# EAGLE schematic layout (EAGLE 9.5.0)
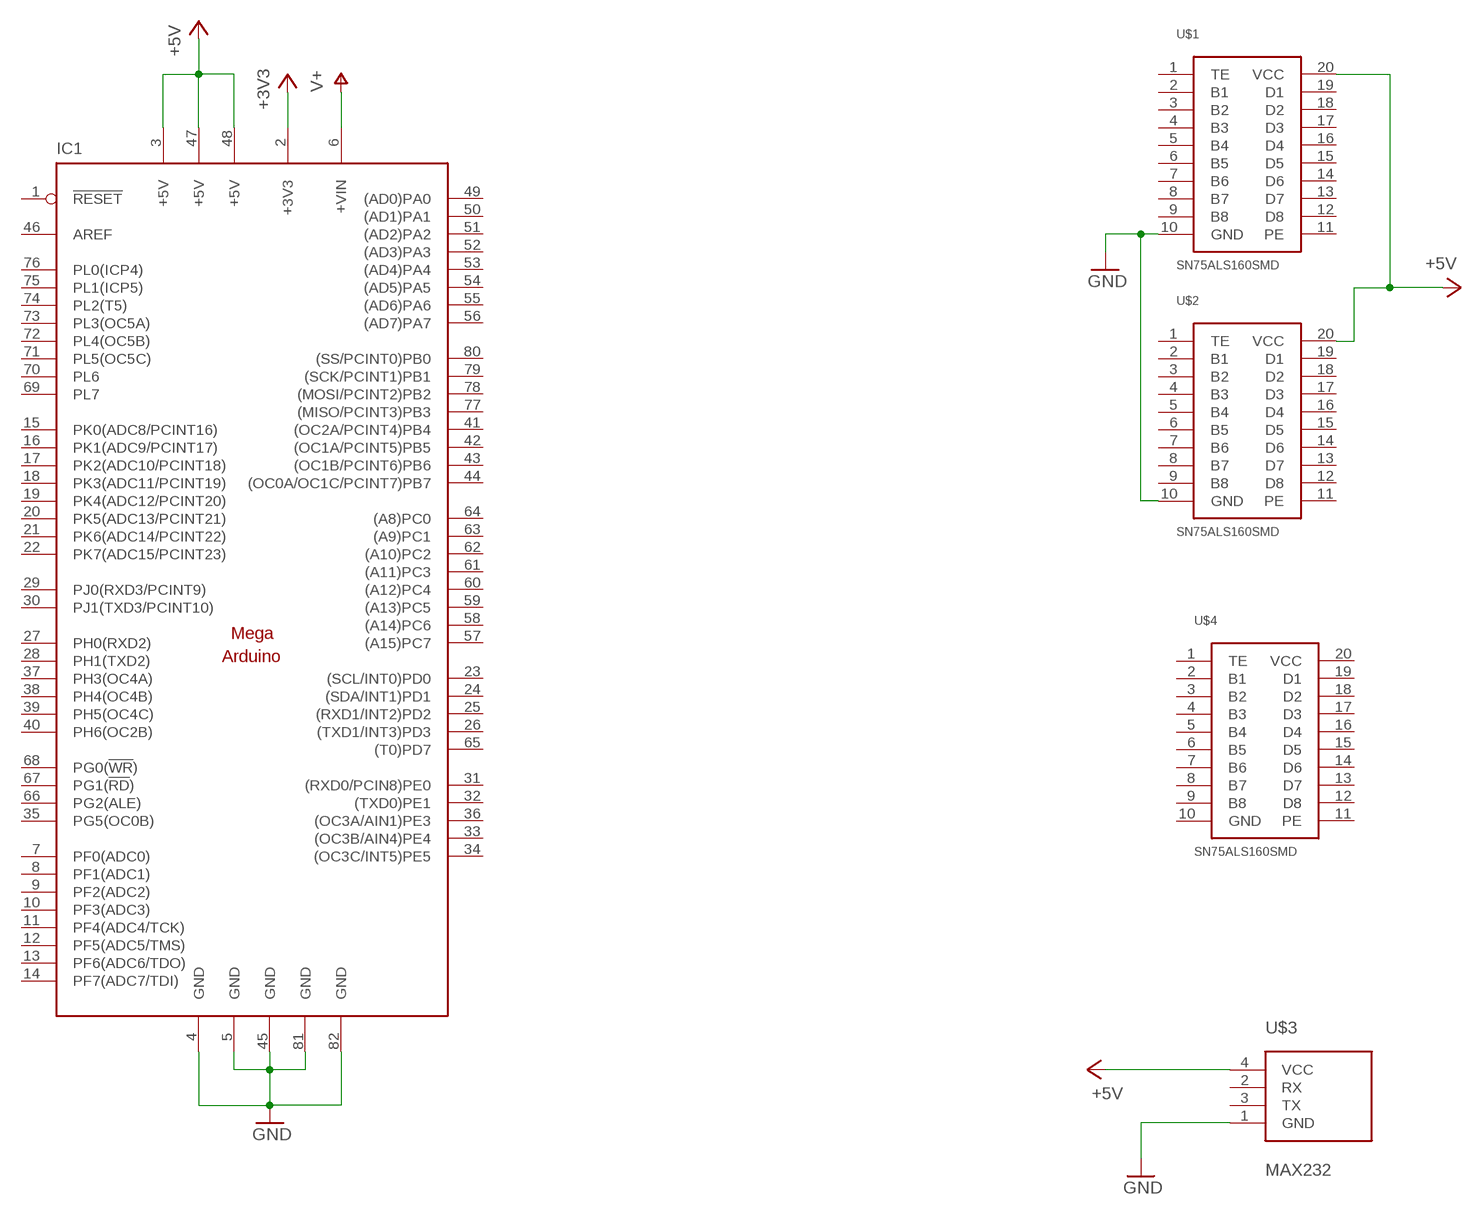
[diagram p0: schematic, sheet 1]

## Parts
IC1  Interface  MEGAARDUINO_1  [MEGA_ARDUINO]
U$1  SN75ALS160SMD  [DW0020A]
U$2  SN75ALS160SMD  [DW0020A]
U$3  MAX232  [4PIN]
U$4  SN75ALS160SMD  [DW0020A]

## Nets
+3V3: IC1.2(+3V3)
+5V: IC1.3(+5V) IC1.47(+5V) IC1.48(+5V) U$1.20(VCC) U$2.20(VCC) U$3.4(VCC)
GND: IC1.4(GND) IC1.5(GND) IC1.45(GND) IC1.81(GND) IC1.82(GND) U$1.10(GND) U$2.10(GND) U$3.1(GND)
V+: IC1.6(+VIN)
Unconnected: IC1.1(!RESET) IC1.7(PF0(ADC0)) IC1.8(PF1(ADC1)) IC1.9(PF2(ADC2)) IC1.10(PF3(ADC3)) IC1.11(PF4(ADC4/TCK)) IC1.12(PF5(ADC5/TMS)) IC1.13(PF6(ADC6/TDO)) IC1.14(PF7(ADC7/TDI)) IC1.15(PK0(ADC8/PCINT16)) IC1.16(PK1(ADC9/PCINT17)) IC1.17(PK2(ADC10/PCINT18)) IC1.18(PK3(ADC11/PCINT19)) IC1.19(PK4(ADC12/PCINT20)) IC1.20(PK5(ADC13/PCINT21)) IC1.21(PK6(ADC14/PCINT22)) IC1.22(PK7(ADC15/PCINT23)) IC1.23((SCL/INT0)PD0) IC1.24((SDA/INT1)PD1) IC1.25((RXD1/INT2)PD2) IC1.26((TXD1/INT3)PD3) IC1.27(PH0(RXD2)) IC1.28(PH1(TXD2)) IC1.29(PJ0(RXD3/PCINT9)) IC1.30(PJ1(TXD3/PCINT10)) IC1.31((RXD0/PCIN8)PE0) IC1.32((TXD0)PE1) IC1.33((OC3B/AIN4)PE4) IC1.34((OC3C/INT5)PE5) IC1.35(PG5(OC0B)) IC1.36((OC3A/AIN1)PE3) IC1.37(PH3(OC4A)) IC1.38(PH4(OC4B)) IC1.39(PH5(OC4C)) IC1.40(PH6(OC2B)) IC1.41((OC2A/PCINT4)PB4) IC1.42((OC1A/PCINT5)PB5) IC1.43((OC1B/PCINT6)PB6) IC1.44((OC0A/OC1C/PCINT7)PB7) IC1.46(AREF) IC1.49((AD0)PA0) IC1.50((AD1)PA1) IC1.51((AD2)PA2) IC1.52((AD3)PA3) IC1.53((AD4)PA4) IC1.54((AD5)PA5) IC1.55((AD6)PA6) IC1.56((AD7)PA7) IC1.57((A15)PC7) IC1.58((A14)PC6) IC1.59((A13)PC5) IC1.60((A12)PC4) IC1.61((A11)PC3) IC1.62((A10)PC2) IC1.63((A9)PC1) IC1.64((A8)PC0) IC1.65((T0)PD7) IC1.66(PG2(ALE)) IC1.67(PG1(!RD!)) IC1.68(PG0(!WR!)) IC1.69(PL7) IC1.70(PL6) IC1.71(PL5(OC5C)) IC1.72(PL4(OC5B)) IC1.73(PL3(OC5A)) IC1.74(PL2(T5)) IC1.75(PL1(ICP5)) IC1.76(PL0(ICP4)) IC1.77((MISO/PCINT3)PB3) IC1.78((MOSI/PCINT2)PB2) IC1.79((SCK/PCINT1)PB1) IC1.80((SS/PCINT0)PB0) U$1.1(TE) U$1.2(B1) U$1.3(B2) U$1.4(B3) U$1.5(B4) U$1.6(B5) U$1.7(B6) U$1.8(B7) U$1.9(B8) U$1.11(PE) U$1.12(D8) U$1.13(D7) U$1.14(D6) U$1.15(D5) U$1.16(D4) U$1.17(D3) U$1.18(D2) U$1.19(D1) U$2.1(TE) U$2.2(B1) U$2.3(B2) U$2.4(B3) U$2.5(B4) U$2.6(B5) U$2.7(B6) U$2.8(B7) U$2.9(B8) U$2.11(PE) U$2.12(D8) U$2.13(D7) U$2.14(D6) U$2.15(D5) U$2.16(D4) U$2.17(D3) U$2.18(D2) U$2.19(D1) U$3.2(RX) U$3.3(TX) U$4.1(TE) U$4.2(B1) U$4.3(B2) U$4.4(B3) U$4.5(B4) U$4.6(B5) U$4.7(B6) U$4.8(B7) U$4.9(B8) U$4.10(GND) U$4.11(PE) U$4.12(D8) U$4.13(D7) U$4.14(D6) U$4.15(D5) U$4.16(D4) U$4.17(D3) U$4.18(D2) U$4.19(D1) U$4.20(VCC)

## Library data of the parts
IC1 = arduino:MEGAARDUINO_1: The Arduino Mega is a microcontroller board based on the ATmega1280. - 54 digital input/output pins (of which 14 can be used as PWM outputs) - 16 analog inputs - 4 UARTs (hardware serial ports) - 16 MHz crystal oscillator - USB connection - power jack - ICSP header - reset button It contains everything needed to support the microcontroller; simply connect it to a computer with a USB cable or power it with a AC-to-DC adapter or battery to get started. The Mega is compatible with most shields designed for the Arduino Duemilanove or Diecimila. http://arduino.cc/en/Main/ArduinoBoardMega
U$1 U$2 U$4 = my1:SN75ALS160
U$3 = my1:MAX232